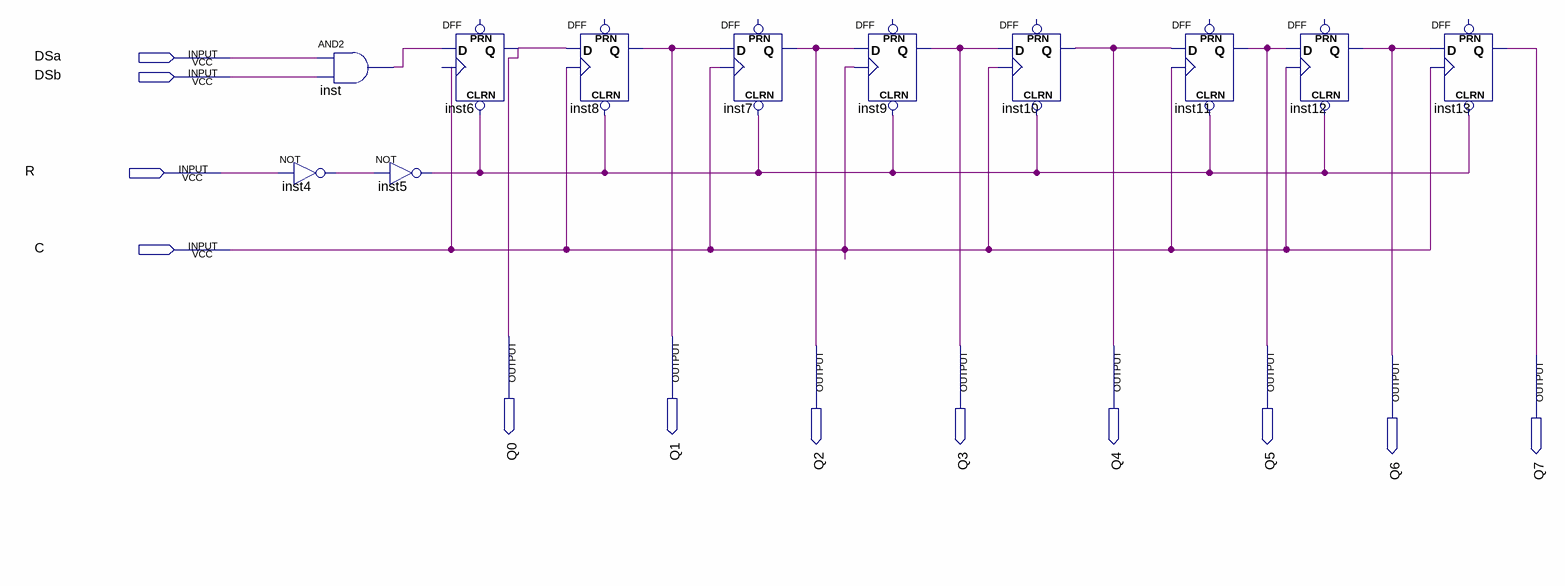
[diagram p0: schematic sheet]
// Quartus schematic rabota.bdf as structural Verilog: 11 symbols, 12 pins
module rabota (
  input  DSa,
  input  DSb,
  input  R,
  input  C,
  output Q0,
  output Q1,
  output Q2,
  output Q3,
  output Q4,
  output Q5,
  output Q6,
  output Q7
);

  wire inst4_out, inst5_out, inst_out;

  not inst4 (inst4_out, R);
  and inst (inst_out, DSa, DSb);
  DFF inst6 (.CLRN(inst5_out), .CLK(C), .D(inst_out), .Q(Q0));  // open: PRN
  not inst5 (inst5_out, inst4_out);
  DFF inst8 (.CLRN(inst5_out), .CLK(C), .D(Q0), .Q(Q1));  // open: PRN
  DFF inst7 (.CLRN(inst5_out), .CLK(C), .D(Q1), .Q(Q2));  // open: PRN
  DFF inst9 (.CLRN(inst5_out), .CLK(C), .D(Q2), .Q(Q3));  // open: PRN
  DFF inst10 (.CLRN(inst5_out), .CLK(C), .D(Q3), .Q(Q4));  // open: PRN
  DFF inst11 (.CLRN(inst5_out), .CLK(C), .D(Q4), .Q(Q5));  // open: PRN
  DFF inst12 (.CLRN(inst5_out), .CLK(C), .D(Q5), .Q(Q6));  // open: PRN
  DFF inst13 (.CLRN(inst5_out), .CLK(C), .D(Q6), .Q(Q7));  // open: PRN
endmodule
